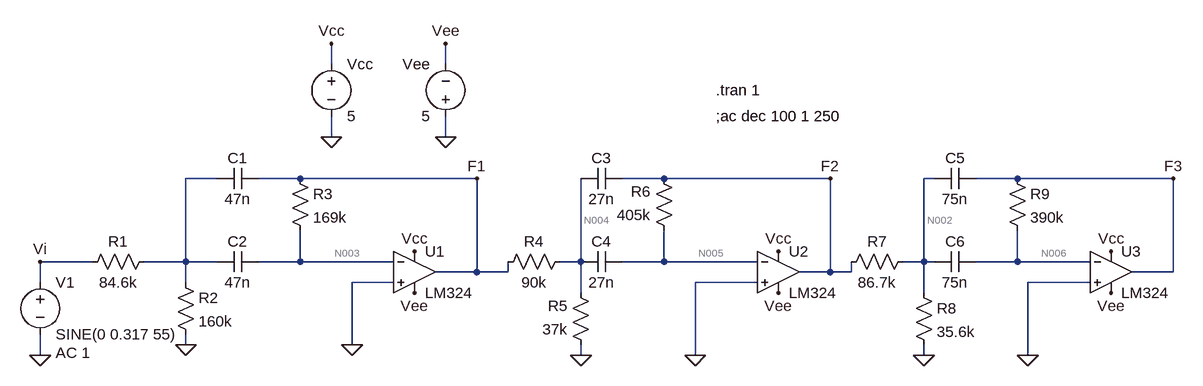
[diagram p0: schematic RealSubBassFilter.asc]
RealSubBassFilter.asc, the LTspice schematic file:
Version 4
SHEET 1 1296 680
WIRE -32 -160 -32 -192
WIRE 144 -160 144 -192
WIRE -32 -48 -32 -80
WIRE 144 -48 144 -80
WIRE -208 16 -256 16
WIRE -80 16 -144 16
WIRE 192 16 -80 16
WIRE 480 16 416 16
WIRE 736 16 480 16
WIRE 896 16 880 16
WIRE 1024 16 960 16
WIRE 1264 16 1024 16
WIRE -400 144 -480 144
WIRE -256 144 -256 16
WIRE -256 144 -320 144
WIRE -208 144 -256 144
WIRE -80 144 -80 96
WIRE -80 144 -144 144
WIRE 64 144 -80 144
WIRE 352 144 352 16
WIRE 352 144 320 144
WIRE 480 144 480 96
WIRE 480 144 416 144
WIRE 624 144 480 144
WIRE 880 144 880 16
WIRE 880 144 848 144
WIRE 896 144 880 144
WIRE 1024 144 1024 96
WIRE 1024 144 960 144
WIRE 1136 144 1024 144
WIRE 192 160 192 16
WIRE 192 160 128 160
WIRE 240 160 240 144
WIRE 240 160 192 160
WIRE 736 160 736 16
WIRE 736 160 688 160
WIRE 768 160 768 144
WIRE 768 160 736 160
WIRE 1264 160 1264 16
WIRE 1264 160 1200 160
WIRE -480 176 -480 144
WIRE -256 176 -256 144
WIRE 64 176 0 176
WIRE 624 176 528 176
WIRE 1136 176 1040 176
WIRE 352 192 352 144
WIRE 880 192 880 144
WIRE -256 272 -256 256
WIRE 0 272 0 176
WIRE -480 288 -480 256
WIRE 352 288 352 272
WIRE 528 288 528 176
WIRE 880 288 880 272
WIRE 1040 288 1040 176
FLAG 528 288 0
FLAG -480 288 0
FLAG 192 16 F1
FLAG 736 16 F2
FLAG -480 144 Vi
FLAG 1040 288 0
FLAG 1264 16 F3
FLAG 880 288 0
FLAG 352 288 0
FLAG -256 272 0
FLAG 0 272 0
FLAG 96 192 Vee
FLAG 96 128 Vcc
FLAG 656 192 Vee
FLAG 656 128 Vcc
FLAG 1168 192 Vee
FLAG 1168 128 Vcc
FLAG -32 -192 Vcc
FLAG -32 -48 0
FLAG 144 -48 0
FLAG 144 -192 Vee
SYMBOL res -304 128 R90
WINDOW 0 0 56 VBottom 2
WINDOW 3 32 56 VTop 2
SYMATTR InstName R1
SYMATTR Value 84.6k
SYMBOL voltage -480 160 R0
WINDOW 123 24 124 Left 2
WINDOW 39 0 0 Left 0
SYMATTR Value2 AC 1
SYMATTR InstName V1
SYMATTR Value SINE(0 0.317 55)
SYMBOL res -272 160 R0
SYMATTR InstName R2
SYMATTR Value 160k
SYMBOL res -96 0 R0
SYMATTR InstName R3
SYMATTR Value 169k
SYMBOL res 336 128 R90
WINDOW 0 0 56 VBottom 2
WINDOW 3 32 56 VTop 2
SYMATTR InstName R4
SYMATTR Value 90k
SYMBOL res 368 288 R180
WINDOW 0 36 76 Left 2
WINDOW 3 36 40 Left 2
SYMATTR InstName R5
SYMATTR Value 37k
SYMBOL res 496 112 R180
WINDOW 0 36 76 Left 2
WINDOW 3 36 40 Left 2
SYMATTR InstName R6
SYMATTR Value 405k
SYMBOL res 752 160 R270
WINDOW 0 32 56 VTop 2
WINDOW 3 0 56 VBottom 2
SYMATTR InstName R7
SYMATTR Value 86.7k
SYMBOL res 864 176 R0
SYMATTR InstName R8
SYMATTR Value 35.6k
SYMBOL res 1008 0 R0
SYMATTR InstName R9
SYMATTR Value 390k
SYMBOL cap -144 0 R90
WINDOW 0 0 32 VBottom 2
WINDOW 3 32 32 VTop 2
SYMATTR InstName C1
SYMATTR Value 47n
SYMBOL cap -144 128 R90
WINDOW 0 0 32 VBottom 2
WINDOW 3 32 32 VTop 2
SYMATTR InstName C2
SYMATTR Value 47n
SYMBOL cap 416 0 R90
WINDOW 0 0 32 VBottom 2
WINDOW 3 32 32 VTop 2
SYMATTR InstName C3
SYMATTR Value 27n
SYMBOL cap 416 128 R90
WINDOW 0 0 32 VBottom 2
WINDOW 3 32 32 VTop 2
SYMATTR InstName C4
SYMATTR Value 27n
SYMBOL cap 960 0 R90
WINDOW 0 0 32 VBottom 2
WINDOW 3 32 32 VTop 2
SYMATTR InstName C5
SYMATTR Value 75n
SYMBOL cap 960 128 R90
WINDOW 0 0 32 VBottom 2
WINDOW 3 32 32 VTop 2
SYMATTR InstName C6
SYMATTR Value 75n
SYMBOL OpAmps\\opamp2 96 96 R0
SYMATTR InstName U1
SYMATTR Value LM324
SYMBOL OpAmps\\opamp2 656 96 R0
SYMATTR InstName U2
SYMATTR Value LM324
SYMBOL OpAmps\\opamp2 1168 96 R0
SYMATTR InstName U3
SYMATTR Value LM324
SYMBOL voltage -32 -176 R0
WINDOW 123 0 0 Left 0
WINDOW 39 0 0 Left 0
SYMATTR InstName Vcc
SYMATTR Value 5
SYMBOL voltage 144 -64 R180
WINDOW 0 24 96 Left 2
WINDOW 3 24 16 Left 2
WINDOW 123 0 0 Left 0
WINDOW 39 0 0 Left 0
SYMATTR InstName Vee
SYMATTR Value 5
TEXT 560 -120 Left 2 !.tran 1
TEXT 560 -80 Left 2 !;ac dec 100 1 250

The netlist it stands for:
* RealSubBassFilter.asc
R1 N001 Vi 84.6k
V1 Vi 0 SINE(0 0.317 55) AC 1
R2 N001 0 160k
R3 F1 N003 169k
R4 N004 F1 90k
R5 0 N004 37k
R6 N005 F2 405k
R7 F2 N002 86.7k
R8 N002 0 35.6k
R9 F3 N006 390k
C1 F1 N001 47n
C2 N003 N001 47n
C3 F2 N004 27n
C4 N005 N004 27n
C5 F3 N002 75n
C6 N006 N002 75n
XU1 0 N003 Vcc Vee F1 LM324  ; pins In+ In- V+ V- OUT
XU2 0 N005 Vcc Vee F2 LM324  ; pins In+ In- V+ V- OUT
XU3 0 N006 Vcc Vee F3 LM324  ; pins In+ In- V+ V- OUT
Vcc Vcc 0 5
Vee 0 Vee 5
.tran 1
;ac dec 100 1 250
.backanno
.end

* Results of the author's LTspice run, read from the files saved beside the schematic
* Operating Point, zero values left out:
*   V(f1) = -3.404 mV
*   V(n003) = -33.62 µV
*   V(n004) = -991.8 µV
*   V(n005) = -33.57 µV
*   V(f2) = -8.111 mV
*   V(n002) = -2.361 mV
*   V(f3) = -7.812 mV
*   V(n006) = -33.58 µV
*   V(vee) = -5 V
*   V(vcc) = 5 V
*   I(R9) = -19.94 nA
*   I(R8) = -66.32 nA
*   I(R7) = -66.32 nA
*   I(R6) = 19.94 nA
*   I(R5) = 26.8 nA
*   I(R4) = 26.8 nA
*   I(R3) = -19.94 nA
*   I(Vee) = -1.02 mA
*   I(Vcc) = -1.02 mA
*   Ix(u1:1) = -19.93 nA
*   Ix(u1:2) = -19.94 nA
*   Ix(u1:3) = 340 µA
*   Ix(u1:4) = -339.9 µA
*   Ix(u1:5) = 46.75 nA
*   Ix(u2:1) = -19.93 nA
*   Ix(u2:2) = -19.94 nA
*   Ix(u2:3) = 340 µA
*   Ix(u2:4) = -339.9 µA
*   Ix(u2:5) = 86.27 nA
*   Ix(u3:1) = -19.93 nA
*   Ix(u3:2) = -19.94 nA
*   Ix(u3:3) = 340 µA
*   Ix(u3:4) = -339.9 µA
*   Ix(u3:5) = 19.94 nA
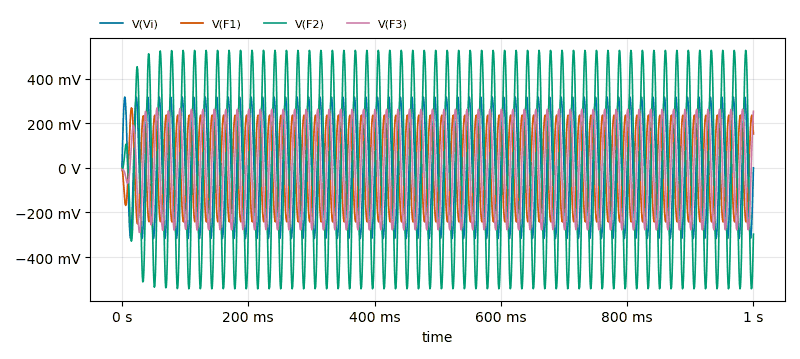
[diagram p1: Transient Analysis of RealSubBassFilter.asc, plotted from the saved traces]
* Transient Analysis, 1 run:
*   V(Vi): min -317 mV, max 317 mV, average -12.22 µV, rms 224.8 mV, last 0 V
*   V(F1): min -251.3 mV, max 268.8 mV, average -2.861 mV, rms 169.8 mV, last 152.1 mV
*   V(F2): min -542.4 mV, max 526.4 mV, average -9.443 mV, rms 376.2 mV, last -297.3 mV
*   V(F3): min -289.3 mV, max 268.2 mV, average -8.111 mV, rms 189.4 mV, last 253.1 mV